# Altium schematic sheet DashBoard_Schematic.SchDoc
size A
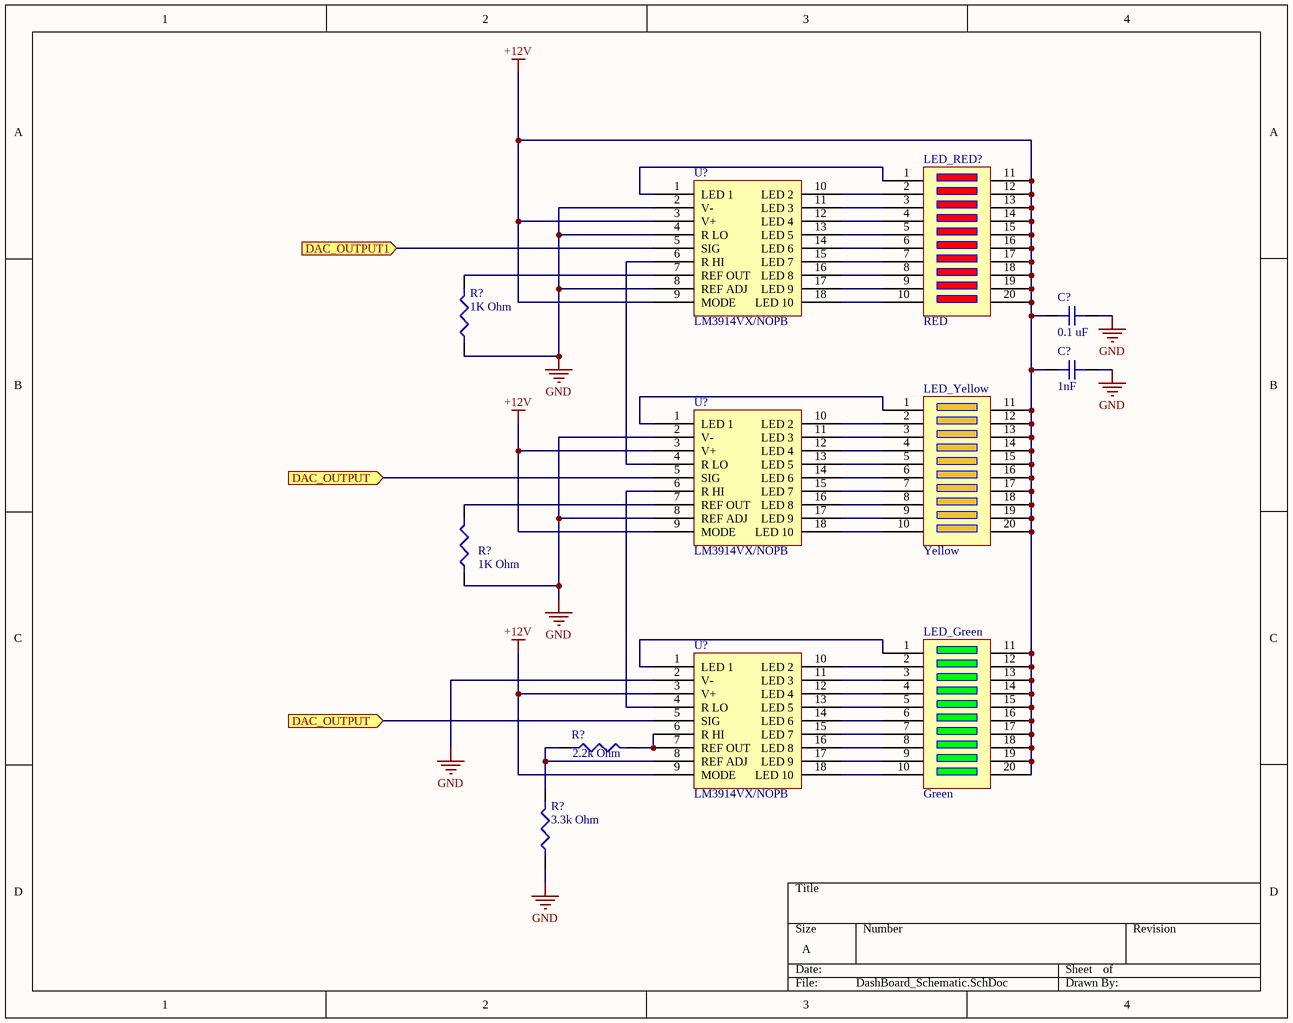
[diagram p0: DashBoard_Schematic.SchDoc]

## Parts
(Parts that share a designator on the sheet are numbered #1, #2 ... from top to bottom, then left to right.)
C?#1  0.1 uF  [CAPC1608X09N]
C?#2  1nF  [CAPC1608X09N]
LED_Green  Green
LED_RED?  RED
LED_Yellow  Yellow
R?#1  1K Ohm  [RESC2012X06N]
R?#2  1K Ohm  [RESC2012X06N]
R?#3  2.2k Ohm  [RESC2012X06N]
R?#4  3.3k Ohm  [RESC2012X06N]
U?#1  LM3914VX/NOPB  [PLCC127P990X990X457-20N]
U?#2  LM3914VX/NOPB  [PLCC127P990X990X457-20N]
U?#3  LM3914VX/NOPB  [PLCC127P990X990X457-20N]

## Ports
DAC_OUTPUT1 (in), DAC_OUTPUT (in)

## Nets
+12V: C?#1.1 C?#2.1 LED_Green.11 LED_Green.12 LED_Green.13 LED_Green.14 LED_Green.15 LED_Green.16 LED_Green.17 LED_Green.18 LED_Green.19 LED_Green.20 LED_RED?.11 LED_RED?.12 LED_RED?.13 LED_RED?.14 LED_RED?.15 LED_RED?.16 LED_RED?.17 LED_RED?.18 LED_RED?.19 LED_RED?.20 LED_Yellow.11 LED_Yellow.12 LED_Yellow.13 LED_Yellow.14 LED_Yellow.15 LED_Yellow.16 LED_Yellow.17 LED_Yellow.18 LED_Yellow.19 LED_Yellow.20 U?#1.3(V+) U?#1.9(MODE) U?#2.3(V+) U?#2.9(MODE) U?#3.3(V+) U?#3.9(MODE)
GND: C?#1.2 C?#2.2 R?#1.1 R?#2.1 R?#4.1 U?#1.2(V-) U?#1.4(R_LO) U?#1.8(REF_ADJ) U?#2.2(V-) U?#2.8(REF_ADJ) U?#3.2(V-)
DAC_OUTPUT: U?#2.5(SIG) U?#3.5(SIG) ; port DAC_OUTPUT
DAC_OUTPUT1: U?#1.5(SIG) ; port DAC_OUTPUT1
NetLED_Green_1: LED_Green.1 U?#3.1(LED_1)
NetLED_Green_2: LED_Green.2 U?#3.10(LED_2)
NetLED_Green_3: LED_Green.3 U?#3.11(LED_3)
NetLED_Green_4: LED_Green.4 U?#3.12(LED_4)
NetLED_Green_5: LED_Green.5 U?#3.13(LED_5)
NetLED_Green_6: LED_Green.6 U?#3.14(LED_6)
NetLED_Green_7: LED_Green.7 U?#3.15(LED_7)
NetLED_Green_8: LED_Green.8 U?#3.16(LED_8)
NetLED_Green_9: LED_Green.9 U?#3.17(LED_9)
NetLED_Green_10: LED_Green.10 U?#3.18(LED_10)
NetLED_RED?_1: LED_RED?.1 U?#1.1(LED_1)
NetLED_RED?_2: LED_RED?.2 U?#1.10(LED_2)
NetLED_RED?_3: LED_RED?.3 U?#1.11(LED_3)
NetLED_RED?_4: LED_RED?.4 U?#1.12(LED_4)
NetLED_RED?_5: LED_RED?.5 U?#1.13(LED_5)
NetLED_RED?_6: LED_RED?.6 U?#1.14(LED_6)
NetLED_RED?_7: LED_RED?.7 U?#1.15(LED_7)
NetLED_RED?_8: LED_RED?.8 U?#1.16(LED_8)
NetLED_RED?_9: LED_RED?.9 U?#1.17(LED_9)
NetLED_RED?_10: LED_RED?.10 U?#1.18(LED_10)
NetLED_Yellow_1: LED_Yellow.1 U?#2.1(LED_1)
NetLED_Yellow_2: LED_Yellow.2 U?#2.10(LED_2)
NetLED_Yellow_3: LED_Yellow.3 U?#2.11(LED_3)
NetLED_Yellow_4: LED_Yellow.4 U?#2.12(LED_4)
NetLED_Yellow_5: LED_Yellow.5 U?#2.13(LED_5)
NetLED_Yellow_6: LED_Yellow.6 U?#2.14(LED_6)
NetLED_Yellow_7: LED_Yellow.7 U?#2.15(LED_7)
NetLED_Yellow_8: LED_Yellow.8 U?#2.16(LED_8)
NetLED_Yellow_9: LED_Yellow.9 U?#2.17(LED_9)
NetLED_Yellow_10: LED_Yellow.10 U?#2.18(LED_10)
NetR?#1_2: R?#1.2 U?#1.7(REF_OUT)
NetR?#2_2: R?#2.2 U?#2.7(REF_OUT)
NetR?#3_1: R?#3.1 R?#4.2 U?#3.8(REF_ADJ)
NetR?#3_2: R?#3.2 U?#3.6(R_HI) U?#3.7(REF_OUT)
NetU?#1_6: U?#1.6(R_HI) U?#2.4(R_LO)
NetU?#2_6: U?#2.6(R_HI) U?#3.4(R_LO)

## Library data of the parts
C?#1 = C0603C104Z3VACTU: KEMET - C0603C104Z3VACTU - Multilayer Ceramic Capacitor, C Series, 0.1 - F, +80%, -20%, Y5V, 25 V, 0603 [1608 Metric] RoHS Compliant: Yes; Capacitance: 100nF; Tolerance: 80%; Voltage Rating: 25V; Dissipation Factor: 7%; Supplier 1: Digi-Key; Manufacturer: KEMET; Manufacturer Part Number: C0603C104Z3VACTU; Stock 1: 1377515; Pricing 1: 1=0.1, 10=0.032, 100=0.0143, 500=0.0102, 1000=0.00802 (USD); Mount: Surface Mount,PCB; Case/Package: 0603; Number of Pins: 2; Case Code (Metric): 1608; Case Code (Imperial): 0603; Dielectric Material: Ceramic; Min Operating Temperature: -30°C; Max Operating Temperature: 85°C; Packaging: Tape and Reel; Voltage Rating (DC): 25V; Package Quantity: 1; Dielectric: Y5V; Termination: SMD/SMT; Voltage: 25V; Length: 1.6mm; Height: 0.8mm; Width: 0.031inch; Thickness: 0.034inch; Lead Pitch: 0.7mm; Depth: 0.8mm; Radiation Hardening: No; REACH SVHC: No SVHC; Lead Free: Lead Free; ComponentLink1URL: http://www.farnell.com/datasheets/1470417.pdf?src-supplier=Element14; ComponentLink1Description: http://www.farnell.com/datasheets/1470417.pdf?src-supplier=Element14; ComponentLink2URL: http://www.farnell.com/datasheets/1828802.pdf?src-supplier=Element14; ComponentLink2Description: http://www.farnell.com/datasheets/1828802.pdf?src-supplier=Element14; ComponentLink3URL: http://www.alliedelec.com/m/d/9bfe7773041ffe9d406e68bc7b377fdd.pdf?src-supplier=Allied+Electronics; ComponentLink3Description: http://www.alliedelec.com/m/d/9bfe7773041ffe9d406e68bc7b377fdd.pdf?src-supplier=Allied+Electronics; Supplier Part Number 1: 399-1100-1-ND
C?#2 = CC0603KRX7R9BB102: CAP CER 1000PF 50V X7R 0603; Manufacturer: Yageo; Material: Ceramic; Tolerance: 10%; Insulation Resistance: 100GR; Supplier 1: Digi-Key; Manufacturer Part Number: CC0603KRX7R9BB102; Stock 1: 5143484; Pricing 1: 1=0.1, 10=0.04, 100=0.018, 500=0.01284, 1000=0.01009 (USD); Mount: Surface Mount; Case/Package: 0603; Number of Pins: 2; Case Code (Metric): 1608; Case Code (Imperial): 0603; Min Operating Temperature: -55°C; Max Operating Temperature: 125°C; Package Quantity: 1; Capacitance: 1nF; Voltage Rating: 50V; Packaging: Tape and Reel; Voltage Rating (DC): 50V; Dielectric: X7R; Termination: SMD/SMT; Composition: Ceramic; Voltage: 50V; Length: 1.6mm; Height: 0.8mm; Width: 0.031inch; Thickness: 0.035inch; Depth: 0.8mm; Radiation Hardening: No; REACH SVHC: No SVHC; Lead Free: Lead Free; Halogen Free: Halogen Free; ComponentLink1URL: http://www.yageo.com/documents/recent/UPY-GPHC_X7R_6.3V-to-50V_18.pdf?src-supplier=Digi-Key; ComponentLink1Description: http://www.yageo.com/documents/recent/UPY-GPHC_X7R_6.3V-to-50V_18.pdf?src-supplier=Digi-Key; ComponentLink2URL: http://www.yageo.com/documents/recent/UPY-GPHC_X7R_6.3V-to-50V_8.pdf?src-supplier=Avnet+Europe; ComponentLink2Description: http://www.yageo.com/documents/recent/UPY-GPHC_X7R_6.3V-to-50V_8.pdf?src-supplier=Avnet+Europe; ComponentLink3URL: https://www.verical.com/server-webapp/html/getDatasheet?partID=251790&src-supplier=Verical; ComponentLink3Description: https://www.verical.com/server-webapp/html/getDatasheet?partID=251790&src-supplier=Verical; ComponentLink4URL: http://www.farnell.com/datasheets/2167236.pdf?src-supplier=Element14; ComponentLink4Description: http://www.farnell.com/datasheets/2167236.pdf?src-supplier=Element14; ComponentLink5URL: https://produktinfo.conrad.com/datenblaetter/425000-449999/445532-da-01-en-KERKO_CHIP_0603_NP0_1000PF.pdf?src-supplier=Conrad; ComponentLink5Description: https://produktinfo.conrad.com/datenblaetter/425000-449999/445532-da-01-en-KERKO_CHIP_0603_NP0_1000PF.pdf?src-supplier=Conrad; Supplier Part Number 1: 311-1080-1-ND
LED_Green = LTA-1000G: LED BAR GRAPH 10-SEGMENT GREEN; Manufacturer: Vishay Lite-On; Shape: Rectangular; Luminous Intensity: 2mcd; Forward Current: 25mA; Forward Voltage: 2.6V; Lens Style: Tinted,Diffused,Rectangular; Voltage Rating: 2.1V; Power Rating: 75mW; Test Current: 10mA; Dominant Wavelength: 569nm; Number of Elements: 10; Wavelength: 565nm; Reverse Voltage: 5V; Supplier 1: Digi-Key; Manufacturer Part Number: LTA-1000G; Stock 1: 7635; Pricing 1: 1=1.4, 10=1.138, 100=0.7, 500=0.595, 1000=0.49, 2500=0.4655, 5000=0.455, 10000=0.4445 (USD); Mount: Through Hole; Case/Package: PDIP; Number of Pins: 20; Color: Green; Number of Terminals: 20; Min Operating Temperature: -35°C; Max Operating Temperature: 85°C; Package Quantity: 20; Packaging: Rail/Tube; Illumination Color: Green; Current: 25mA; Power Dissipation: 75mW; Number of LEDs: 10; Length: 25.27mm; Width: 10.2mm; Depth: 10.16mm; Radiation Hardening: No; Lead Free: Lead Free; ComponentLink1URL: http://optoelectronics.liteon.com/upload/download/DS-30-92-0809/A1000G.pdf?src-supplier=Digi-Key; ComponentLink1Description: http://optoelectronics.liteon.com/upload/download/DS-30-92-0809/A1000G.pdf?src-supplier=Digi-Key; ComponentLink2URL: http://www1.futureelectronics.com/doc/LITE-ON/LITE-ON%20LTA-1000G.pdf?src-supplier=Future+Electronics; ComponentLink2Description: http://www1.futureelectronics.com/doc/LITE-ON/LITE-ON%20LTA-1000G.pdf?src-supplier=Future+Electronics; ComponentLink3URL: http://www.jameco.com/Jameco/Products/ProdDS/697469.pdf?src-supplier=Jameco; ComponentLink3Description: http://www.jameco.com/Jameco/Products/ProdDS/697469.pdf?src-supplier=Jameco; ComponentLink4URL: https://www.verical.com/server-webapp/html/getDatasheet?partID=103036&src-supplier=Verical; ComponentLink4Description: https://www.verical.com/server-webapp/html/getDatasheet?partID=103036&src-supplier=Verical; ComponentLink5URL: http://www.mouser.com/ds/2/239/S_110_A1000G-369759.pdf?src-supplier=Mouser; ComponentLink5Description: http://www.mouser.com/ds/2/239/S_110_A1000G-369759.pdf?src-supplier=Mouser; Supplier Part Number 1: 160-1067-ND
LED_RED? = LTA-1000HR: LED BAR GRAPH 10-SEGMENT RED; Manufacturer: Vishay Lite-On; Shape: Rectangular; Current: 25mA; Forward Voltage: 2.6V; Test Current: 10mA; Voltage Rating: 2V; Luminous Intensity: 2mcd; Lens Style: Tinted,Diffused,Rectangular; Power Rating: 75mW; Dominant Wavelength: 623nm; Number of Elements: 10; Wavelength: 635nm; Reverse Voltage: 5V; Supplier 1: Digi-Key; Manufacturer Part Number: LTA-1000HR; Stock 1: 21663; Pricing 1: 1=1.4, 10=1.138, 100=0.7, 500=0.595, 1000=0.49, 2500=0.4655, 5000=0.455, 10000=0.4445 (USD); Mount: Through Hole; Case/Package: PDIP; Number of Pins: 20; Color: Red; Number of Terminals: 20; Min Operating Temperature: -35°C; Max Operating Temperature: 85°C; Package Quantity: 20; Packaging: Rail/Tube; Forward Current: 25mA; Illumination Color: Red; Power Dissipation: 75mW; Number of LEDs: 10; Length: 25.27mm; Width: 10.2mm; Depth: 10.16mm; Radiation Hardening: No; Lead Free: Lead Free; ComponentLink1URL: http://optoelectronics.liteon.com/upload/download/DS-30-92-0810/LTA-1000HR.pdf?src-supplier=Digi-Key; ComponentLink1Description: http://optoelectronics.liteon.com/upload/download/DS-30-92-0810/LTA-1000HR.pdf?src-supplier=Digi-Key; ComponentLink2URL: http://www.jameco.com/Jameco/Products/ProdDS/697477.pdf?src-supplier=Jameco; ComponentLink2Description: http://www.jameco.com/Jameco/Products/ProdDS/697477.pdf?src-supplier=Jameco; ComponentLink3URL: http://www.mouser.com/ds/2/239/S_110_LTA-1000HR-369780.pdf?src-supplier=Mouser; ComponentLink3Description: http://www.mouser.com/ds/2/239/S_110_LTA-1000HR-369780.pdf?src-supplier=Mouser; ComponentLink4URL: http://www.onlinecomponents.com/productFiles/mf-LI/2s_110_lta-1000hr.pdf?src-supplier=Onlinecomponents.com; ComponentLink4Description: http://www.onlinecomponents.com/productFiles/mf-LI/2s_110_lta-1000hr.pdf?src-supplier=Onlinecomponents.com; Supplier Part Number 1: 160-1066-ND
LED_Yellow = LTA-1000Y: LED BAR GRAPH 10-SEGMENT YELLOW; Manufacturer: Vishay Lite-On; Max Power Dissipation: 60mW; Voltage Rating: 2.1V; Forward Current: 20mA; Wavelength: 588nm; Luminous Intensity: 2mcd; Forward Voltage: 2.6V; Lens Style: Tinted,Rectangular; Number of Elements: 10; Reverse Voltage: 5V; Supplier 1: Digi-Key; Manufacturer Part Number: LTA-1000Y; Stock 1: 446; Pricing 1: 1=1.4, 10=1.138, 100=0.7, 500=0.595, 1000=0.49, 2500=0.4655, 5000=0.455, 10000=0.4445 (USD); Mount: Through Hole; Case/Package: PDIP; Number of Pins: 20; Color: Yellow; Min Operating Temperature: -35°C; Max Operating Temperature: 85°C; Package Quantity: 20; Packaging: Rail/Tube; Power Rating: 60mW; Illumination Color: Yellow; Current: 20mA; Dominant Wavelength: 588nm; Power Dissipation: 60mW; Test Current: 20mA; Number of LEDs: 10; Length: 25.27mm; Width: 10.16mm; Depth: 10.16mm; Radiation Hardening: No; Lead Free: Lead Free; ComponentLink1URL: https://media.digikey.com/pdf/Data%20Sheets/Lite-On%20PDFs/LTA-1000Y.pdf?src-supplier=Digi-Key; ComponentLink1Description: https://media.digikey.com/pdf/Data%20Sheets/Lite-On%20PDFs/LTA-1000Y.pdf?src-supplier=Digi-Key; ComponentLink2URL: http://www.mouser.com/ds/2/239/_100_A1000Y-61118.pdf?src-supplier=Mouser; ComponentLink2Description: http://www.mouser.com/ds/2/239/_100_A1000Y-61118.pdf?src-supplier=Mouser; ComponentLink3URL: https://www.verical.com/server-webapp/html/getDatasheet?partID=145555&src-supplier=Verical; ComponentLink3Description: https://www.verical.com/server-webapp/html/getDatasheet?partID=145555&src-supplier=Verical; Supplier Part Number 1: 160-1068-ND
R?#1 R?#2 = RC0805JR-071KL: RES SMD 1K OHM 5% 1/8W 0805; Manufacturer: Yageo; Resistance: 1kR; Power Rating: 125mW; Voltage Rating: 150V; Temperature Coefficient: 100ppm/°C; Supplier 1: Digi-Key; Manufacturer Part Number: RC0805JR-071KL; Stock 1: 6376783; Pricing 1: 1=0.1, 10=0.032, 100=0.0132, 1000=0.00594, 2500=0.00515 (USD); Case/Package: 0805; Case Code (Imperial): 0805; Case Code (Metric): 2012; Contact Plating: Tin,Lead,Matte; Min Operating Temperature: -55°C; Max Operating Temperature: 155°C; Tolerance: 5%; Packaging: Tape and Reel; Termination: SMD/SMT; Composition: Thick Film; Military Standard: Not; Length: 2mm; Depth: 1.25mm; Radiation Hardening: No; REACH SVHC: Unknown; Lead Free: Lead Free; ComponentLink1URL: http://www.farnell.com/datasheets/2167052.pdf?src-supplier=Verical; ComponentLink1Description: http://www.farnell.com/datasheets/2167052.pdf?src-supplier=Verical; ComponentLink2URL: http://www.farnell.com/datasheets/2167052.pdf?src-supplier=Mouser; ComponentLink2Description: http://www.farnell.com/datasheets/2167052.pdf?src-supplier=Mouser; ComponentLink3URL: http://www.farnell.com/datasheets/2167052.pdf?src-supplier=Element14; ComponentLink3Description: http://www.farnell.com/datasheets/2167052.pdf?src-supplier=Element14; ComponentLink4URL: http://www.farnell.com/datasheets/444164.pdf?src-supplier=Element14; ComponentLink4Description: http://www.farnell.com/datasheets/444164.pdf?src-supplier=Element14; Supplier Part Number 1: 311-1.0KARDKR-ND
R?#3 = RC0805FR-072K2L: RES SMD 2.2K OHM 1% 1/8W 0805; Manufacturer: Yageo; Power Rating: 125mW; Resistance: 2.2kR; Temperature Coefficient: 100ppm/°C; Voltage Rating: 150V; Supplier 1: Digi-Key; Manufacturer Part Number: RC0805FR-072K2L; Stock 1: 4627797; Pricing 1: 1=0.1, 10=0.04, 100=0.0163, 1000=0.00731, 2500=0.00635 (USD); Case/Package: 0805; Number of Pins: 2; Case Code (Imperial): 0805; Case Code (Metric): 2012; Min Operating Temperature: -55°C; Max Operating Temperature: 155°C; Tolerance: 1%; Packaging: Tape and Reel; Voltage Rating (DC): 150V; Package Quantity: 1; Termination: SMD/SMT; Composition: Thick Film; Number of Terminations: 2; Max Power Dissipation: 125mW; Features: Moisture Resistant; Military Standard: Not; Length: 2mm; Height: 0.5mm; Width: 1.25mm; Depth: 1.25mm; Lead Pitch: 0.4mm; REACH SVHC: Unknown; Lead Free: Lead Free; ComponentLink1URL: http://www.farnell.com/datasheets/38627.pdf?src-supplier=Element14; ComponentLink1Description: http://www.farnell.com/datasheets/38627.pdf?src-supplier=Element14; ComponentLink2URL: http://www.farnell.com/datasheets/444164.pdf?src-supplier=Element14; ComponentLink2Description: http://www.farnell.com/datasheets/444164.pdf?src-supplier=Element14; ComponentLink3URL: http://www.yageo.com/documents/recent/PYu-RC_Group_51_RoHS_L_9.pdf?src-supplier=Digi-Key; ComponentLink3Description: http://www.yageo.com/documents/recent/PYu-RC_Group_51_RoHS_L_9.pdf?src-supplier=Digi-Key; ComponentLink4URL: http://www.yageo.com/documents/recent/PYu-RC_Group_51_RoHS_L_10.pdf?src-supplier=Digi-Key; ComponentLink4Description: http://www.yageo.com/documents/recent/PYu-RC_Group_51_RoHS_L_10.pdf?src-supplier=Digi-Key; Supplier Part Number 1: 311-2.20KCRCT-ND
R?#4 = ERA-6AEB332V: Thin Film Resistors - SMD 0805 1/8W 3.3Kohms; Manufacturer: Panasonic; Tolerance: 0.1%; Power Rating: 125mW; Voltage Rating: 100V; Resistance: 3.3kR; Temperature Coefficient: 25ppm/°C; Supplier 1: Digi-Key; Manufacturer Part Number: ERA-6AEB332V; Stock 1: 81370; Pricing 1: 1=0.36, 10=0.302, 100=0.1182, 1000=0.04948, 2500=0.04536 (USD); Mount: Surface Mount; Case/Package: 0805; Number of Pins: 2; Case Code (Metric): 2012; Case Code (Imperial): 0805; Contact Plating: Tin; Min Operating Temperature: -55°C; Max Operating Temperature: 155°C; Packaging: Tape and Reel; Package Quantity: 1; Composition: Thin Film,Metal Film; Number of Terminations: 2; Termination: SMD/SMT; Military Standard: Not; Max Power Dissipation: 125mW; Voltage Rating (DC): 100V; Features: Automotive AEC-Q200; Length: 2mm; Height: 0.5mm; Width: 1.25mm; Depth: 1.25mm; Radiation Hardening: No; REACH SVHC: No SVHC; Lead Free: Lead Free; ComponentLink1URL: http://www.farnell.com/datasheets/485442.pdf?src-supplier=Farnell; ComponentLink1Description: http://www.farnell.com/datasheets/485442.pdf?src-supplier=Farnell; ComponentLink2URL: http://uk.rs-online.com/webdocs/0bee/0900766b80beefcc.pdf?src-supplier=RSComponents; ComponentLink2Description: http://uk.rs-online.com/webdocs/0bee/0900766b80beefcc.pdf?src-supplier=RSComponents; ComponentLink3URL: http://industrial.panasonic.com/www-data/pdf/AOA0000/AOA0000CE26.pdf?src-supplier=Future+Electronics; ComponentLink3Description: http://industrial.panasonic.com/www-data/pdf/AOA0000/AOA0000CE26.pdf?src-supplier=Future+Electronics; ComponentLink4URL: https://www.alliedelec.com/m/d/b6b0537e86f421aa7f5975bb1d8f429a.pdf?src-supplier=Allied+Electronics; ComponentLink4Description: https://www.alliedelec.com/m/d/b6b0537e86f421aa7f5975bb1d8f429a.pdf?src-supplier=Allied+Electronics; ComponentLink5URL: http://industrial.panasonic.com/www-data/pdf/AOA0000/AOA0000CE26.pdf?src-supplier=Avnet; ComponentLink5Description: http://industrial.panasonic.com/www-data/pdf/AOA0000/AOA0000CE26.pdf?src-supplier=Avnet; ComponentLink6URL: http://industrial.panasonic.com/www-data/pdf/AOA0000/AOA0000CE26.pdf?src-supplier=Avnet+Europe; ComponentLink6Description: http://industrial.panasonic.com/www-data/pdf/AOA0000/AOA0000CE26.pdf?src-supplier=Avnet+Europe; ComponentLink7URL: http://industrial.panasonic.com/cdbs/www-data/pdf/RDM0000/AOA0000C307.pdf?src-supplier=Farnell; ComponentLink7Description: http://industrial.panasonic.com/cdbs/www-data/pdf/RDM0000/AOA0000C307.pdf?src-supplier=Farnell; ComponentLink8URL: https://www.distrelec.biz/Web/Downloads/_t/ds/ERA_eng_tds.pdf?mime=application%2Fpdf&src-supplier=Distrelec; ComponentLink8Description: https://www.distrelec.biz/Web/Downloads/_t/ds/ERA_eng_tds.pdf?mime=application%2Fpdf&src-supplier=Distrelec; ComponentLink9URL: http://www.farnell.com/datasheets/485442.pdf?src-supplier=Element14; ComponentLink9Description: http://www.farnell.com/datasheets/485442.pdf?src-supplier=Element14; ComponentLink10URL: http://www.farnell.com/datasheets/2052875.pdf?src-supplier=Farnell; ComponentLink10Description: http://www.farnell.com/datasheets/2052875.pdf?src-supplier=Farnell; ComponentLink11URL: http://www.farnell.com/datasheets/2059650.pdf?src-supplier=Farnell; ComponentLink11Description: http://www.farnell.com/datasheets/2059650.pdf?src-supplier=Farnell; ComponentLink12URL: https://produktinfo.conrad.com/datenblaetter/450000-474999/453184-da-01-en-WIDERSTAND_0805_ERA.pdf?src-supplier=Conrad; ComponentLink12Description: https://produktinfo.conrad.com/datenblaetter/450000-474999/453184-da-01-en-WIDERSTAND_0805_ERA.pdf?src-supplier=Conrad; Supplier Part Number 1: P3.3KDADKR-ND
U?#1-U?#3 = LM3914VX/NOPB: LED DRVR 10Segment 20-Pin PLCC T/R; Manufacturer: TI National Semiconductor; Nominal Supply Current: 9.2mA; Max Supply Voltage: 25V; Max Power Dissipation: 1.365W; Output Current: 30mA; Number of Outputs: 10; Display Type: LCD; Supplier 1: Digi-Key; Manufacturer Part Number: LM3914VX/NOPB; Stock 1: 238; Pricing 1: 1=3.82, 10=3.43, 100=2.8099, 500=2.39202 (USD); Mount: Surface Mount; Case/Package: PLCC; Number of Pins: 20; Min Operating Temperature: 0°C; Max Operating Temperature: 70°C; Packaging: Tape and Reel; Package Quantity: 1000; Max Supply Current: 9.2mA; Power Dissipation: 1.365W; Number of Segments: 10; Number of Channels: 10; Width: 8.89mm; Radiation Hardening: No; Lead Free: Lead Free; ComponentLink1URL: http://www.ti.com/general/docs/lit/getliterature.tsp?genericPartNumber=LM3914&&fileType=pdf&src-supplier=Avnet; ComponentLink1Description: http://www.ti.com/general/docs/lit/getliterature.tsp?genericPartNumber=LM3914&&fileType=pdf&src-supplier=Avnet; ComponentLink2URL: http://www.jameco.com/Jameco/Products/ProdDS/1282476.pdf?src-supplier=Jameco; ComponentLink2Description: http://www.jameco.com/Jameco/Products/ProdDS/1282476.pdf?src-supplier=Jameco; ComponentLink3URL: http://www.ti.com/lit/ds/symlink/lm3914.pdf?src-supplier=Digi-Key; ComponentLink3Description: http://www.ti.com/lit/ds/symlink/lm3914.pdf?src-supplier=Digi-Key; ComponentLink4URL: https://www.verical.com/server-webapp/html/getDatasheet?partID=632645&src-supplier=Verical; ComponentLink4Description: https://www.verical.com/server-webapp/html/getDatasheet?partID=632645&src-supplier=Verical; Supplier Part Number 1: LM3914VX/NOPBDKR-ND